# EAGLE schematic Fuzz (EAGLE 9.3.0)

## Sheet 1 of 2
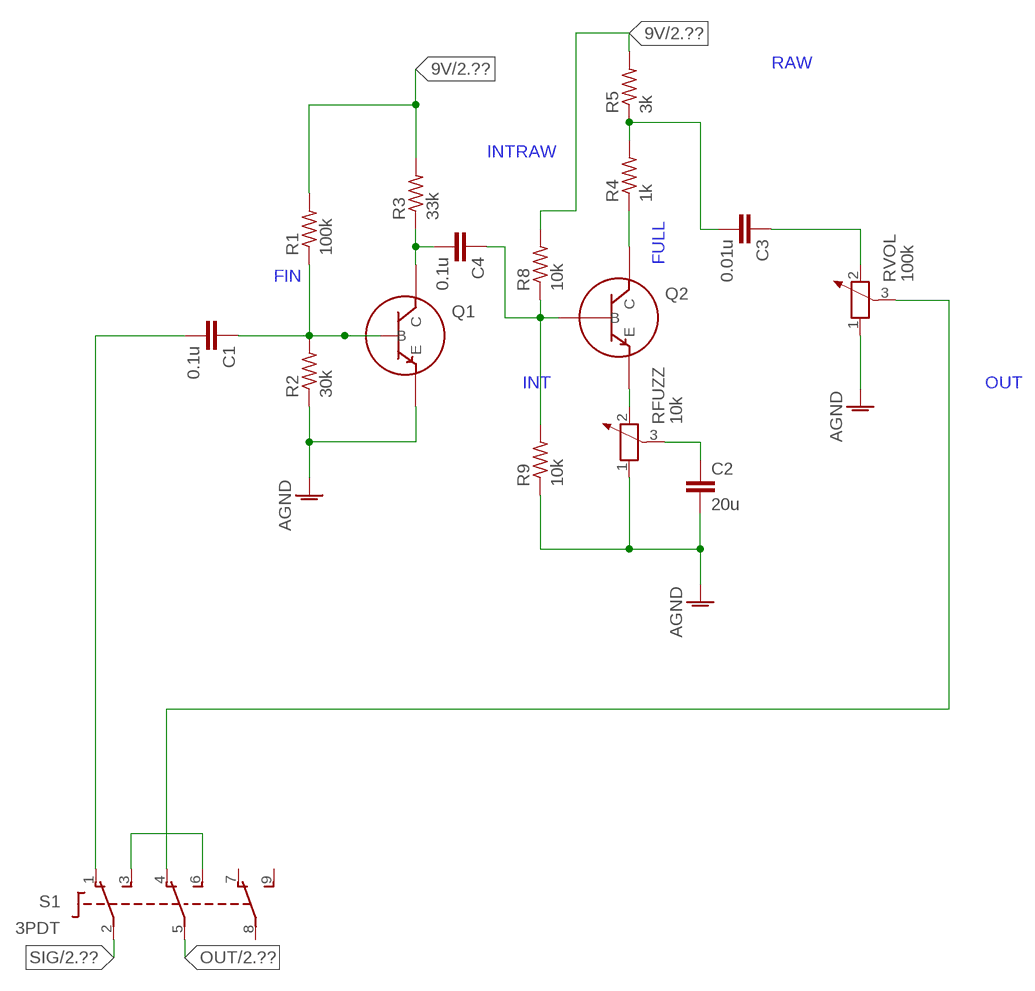
[diagram p0: schematic, sheet 1]

### Parts
C1  0.1u  C-EU025-024X044  [C025-024X044]
C2  20u  C-EU025-024X044  [C025-024X044]
C3  0.01u  C-EU025-024X044  [C025-024X044]
C4  0.1u  C-EU025-024X044  [C025-024X044]
Q1  BJT_NPN  (no package)
Q2  BJT_NPN  (no package)
R1  100k  R-US_0204/2V  [0204V]
R2  30k  R-US_0204/2V  [0204V]
R3  33k  R-US_0204/2V  [0204V]
R4  1k  R-US_0204/2V  [0204V]
R5  3k  R-US_0204/2V  [0204V]
R8  10k  R-US_0204/2V  [0204V]
R9  10k  R-US_0204/2V  [0204V]
RFUZZ  10k  POTENTIOMETER_PT-10  [PT-10]
RVOL  100k  POTENTIOMETER_PT-10  [PT-10]
S1  3PDT  [3PDT]

### Nets
9V: R1.2 R3.2 R5.2 R8.2 ; also sheet 2
AGND: C2.2 Q1.E R2.1 R9.1 RFUZZ.1 RVOL.1 ; also sheet 2
FIN: C1.1 Q1.B R1.1 R2.2
FULL: Q2.C R4.1
INT: C4.1 Q2.B R8.1 R9.2
INTRAW: C4.2 Q1.C R3.1
N$1: Q2.E RFUZZ.2
N$2: S1.3(S1) S1.6(S2)
N$3: C1.2 S1.1(O1)
N$4: C3.1 RVOL.2
N$5: C2.1 RFUZZ.3
OUT: RVOL.3 S1.4(O2) S1.5(P2) ; also sheet 2
RAW: C3.2 R4.2 R5.1
SIG: S1.2(P1) ; also sheet 2
Unconnected: S1.7(O3) S1.8(P3) S1.9(S3)

## Sheet 2 of 2
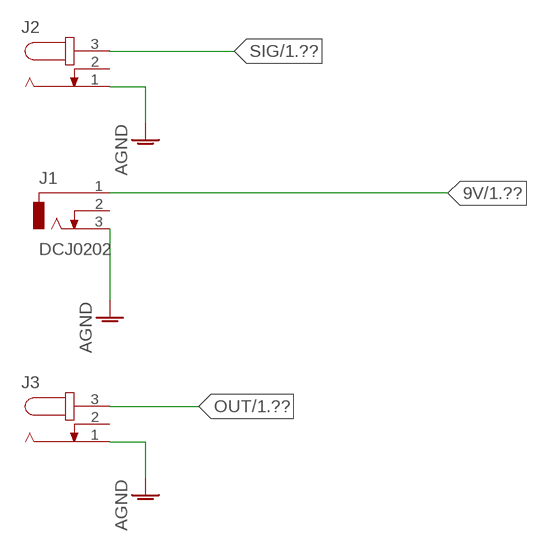
[diagram p1: schematic, sheet 2]

### Parts
J1  DCJ0202  [DCJ0202]
J2  JACK-PLUG1  [SPC4078]
J3  JACK-PLUG1  [SPC4078]

### Nets
9V: J1.1 ; also sheet 1
AGND: J1.3 J2.1 J3.1 ; also sheet 1
OUT: J3.3 ; also sheet 1
SIG: J2.3 ; also sheet 1
Unconnected: J1.2 J2.2 J3.2

## Library data of the parts
C1-C4 = rcl:C-EU: CAPACITOR, European symbol; SPICEPREFIX: C
J1 = con-jack:DCJ0202: DC POWER JACK Source: DCJ0202.pdf; OC_FARNELL: unknown; OC_NEWARK: unknown
J2 J3 = con-jack:JACK-PLUG: DC POWER JACK Power Jack, DC, Right Angle, Through Hole, Rated 5A at 16VDC, PC Terminals Distributor: Farnell (www.Farnell.de) Drawing: 84N1161.pdf / 84N1162.pdf Manufacturer: SPC Technology (www.spctechnology.com) Type: SPC4077 / SPC 4078; OC_FARNELL: unknown; OC_NEWARK: unknown
Q1 Q2 = ngspice-simulation:BJT_NPN: Bipolar NPN Transistor; SPICEPREFIX: Q
R1-R5 R8 R9 = rcl:R-US_: RESISTOR, American symbol; SPICEPREFIX: R
RFUZZ RVOL = rcl:POTENTIOMETER_: Potentiometer; SPICEMODEL: POT; SPICEPREFIX: X
S1 = switch:3PDT: 3PDT 9 pin footswitch SF17020F-0302-21R-L Source: 3PDT.jpg